# Altium project Communications.PrjPcb
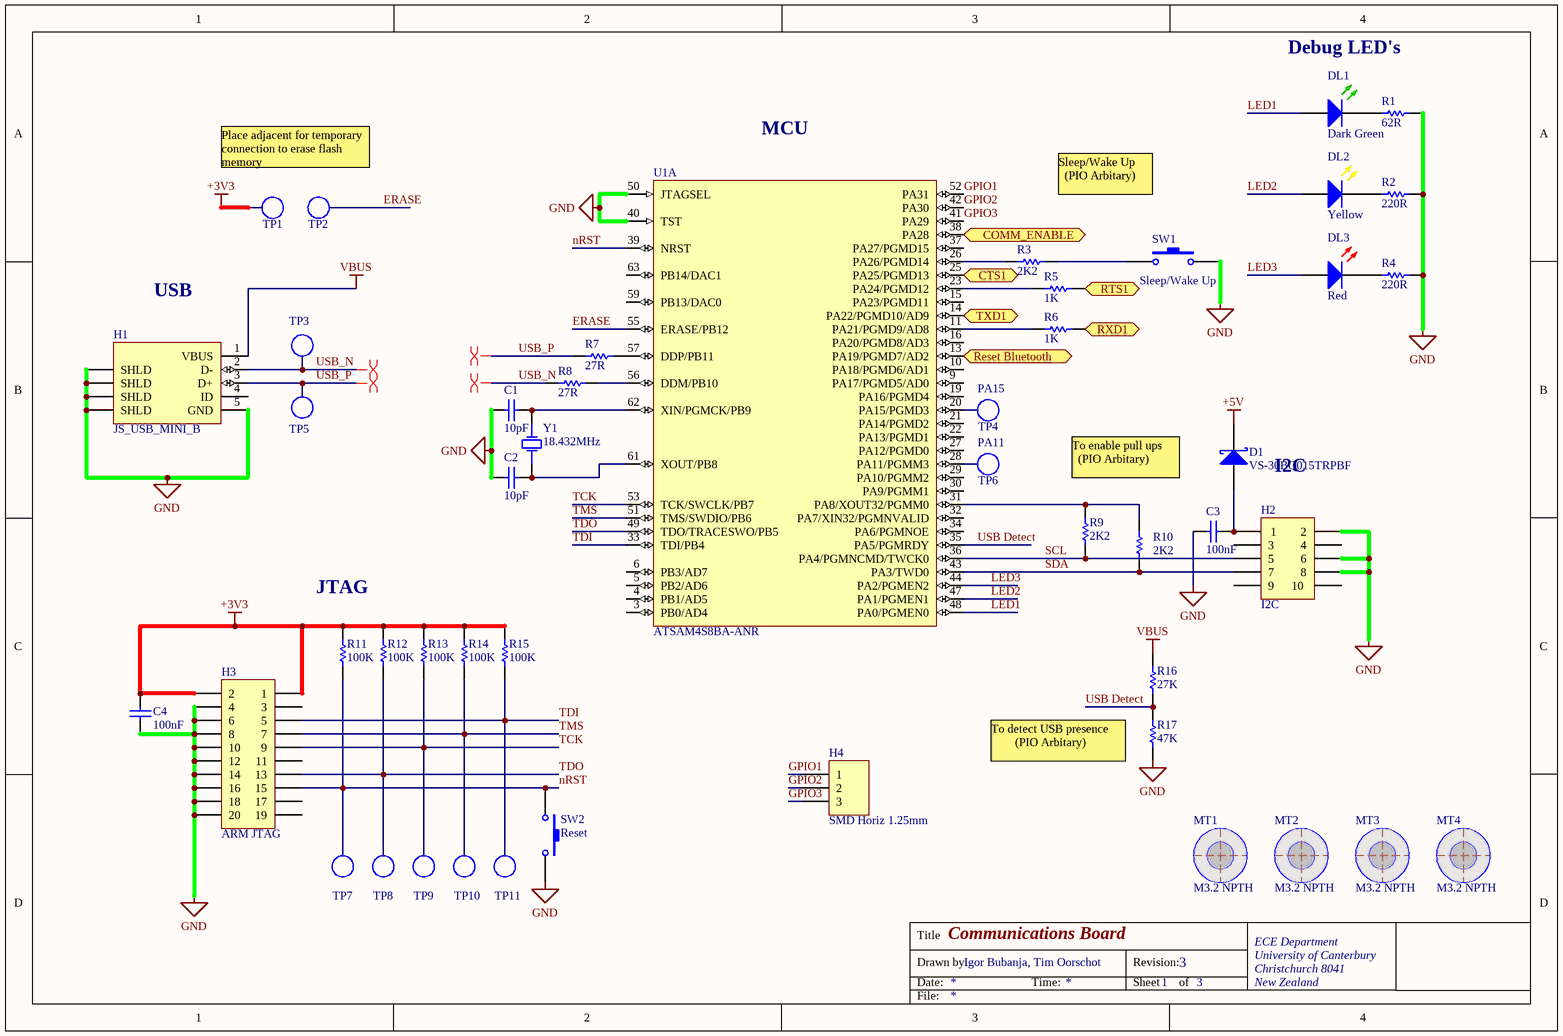
[diagram p0: Communications_Board.SchDoc]
3 sheets, 97 parts. Net scope: flat (ports and power ports of the same name join across sheets).
Board files: Igor's PCB.PcbDoc, Communications_Board.PcbDoc
Sheets:
  Communications_Board.SchDoc
  Communications_Module.SchDoc
  Communications_Power.SchDoc

## Sheet Communications_Board.SchDoc: Communications Board
size A4; DrawnBy: Igor Bubanja, Tim Oorschot; Address1: ECE Department; Address2: University of Canterbury; Address3: Christchurch 8041; Address4: New Zealand; Revision: 3; SheetNumber: 1; SheetTotal: 3; PageSetup: Record=PageOptions|CenterHorizontal=True|CenterVertical=True|PrintScale=0.97|XCorrection=1.00|YCorrection=1.00|PrintKind=0|BorderSize=5000000|LeftOffset=0|BottomOffset=0|Orientation=2|PaperLength=1000|PaperWidth=1000|Scale=100|PaperSource=7|PrintQuality=-3|MediaType=1|DitherType=10|PrintScaleMode=1|PaperKind=A4 (210 x 297 mm)|PaperIndex=9

### Parts
C1  10pF  [CAPC1608L]
C2  10pF  [CAPC1608L]
C3  100nF  [CAPC1608L]
C4  100nF  [CAPC1608L]
D1  VS-30BQ015TRPBF  [SMC]
DL1  Dark Green  [WL-SMCW0603]
DL2  Yellow  [WL-SMCW0603]
DL3  Red  [WL-SMCW0603]
H1  JS_USB_MINI_B  [USB/SM0.8-6H5]
H2  I2C  [188275-10]
H3  ARM JTAG  [188275-20]
H4  SMD Horiz 1.25mm  [SD-53261-0319]
MT1  M3.2 NPTH  [MNT-HOLE_3.2mm_NPTH]  (no BOM)
MT2  M3.2 NPTH  [MNT-HOLE_3.2mm_NPTH]  (no BOM)
MT3  M3.2 NPTH  [MNT-HOLE_3.2mm_NPTH]  (no BOM)
MT4  M3.2 NPTH  [MNT-HOLE_3.2mm_NPTH]  (no BOM)
R1  62R  [RESC1608L]
R2  220R  [RESC1608L]
R3  2K2  [RESC1608L]
R4  220R  [RESC1608L]
R5  1K  [RESC1608L]
R6  1K  [RESC1608L]
R7  27R  [RESC1608L]
R8  27R  [RESC1608L]
R9  2K2  [RESC1608L]
R10  2K2  [RESC1608L]
R11  100K  [RESC1608L]
R12  100K  [RESC1608L]
R13  100K  [RESC1608L]
R14  100K  [RESC1608L]
R15  100K  [RESC1608L]
R16  27K  [RESC1608N]
R17  47K  [RESC1608N]
SW1  Sleep/Wake Up  [KSR211G]
SW2  Reset  [KSR211G]
TP1  3V3  [TP_0805]  (value not drawn)
TP2  Erase  [TP_0805]  (value not drawn)
TP3  USB_N  [TP_0805]  (value not drawn)
TP4  PA15  [TP_0805]
TP5  USB_P  [TP_0805]  (value not drawn)
TP6  PA11  [TP_0805]
TP7  nRST  [TP_0805]  (value not drawn)
TP8  TDO  [TP_0805]  (value not drawn)
TP9  TCK  [TP_0805]  (value not drawn)
TP10  TMS  [TP_0805]  (value not drawn)
TP11  TDI  [TP_0805]  (value not drawn)
U1  ATSAM4S8BA-ANR  [LQFP64_L]  (part A of 2)
Y1  18.432MHz  [6.0X3.5-4]

### Ports
COMM_ENABLE (out), CTS1, Reset Bluetooth (out), RTS1, RXD1, TXD1

### Nets
+3V3: C4.2 H3.1 H3.2 R11.2 R12.2 R13.2 R14.2 R15.2 TP1.1(TP)
+5V: D1.2(K)
GND: C1.1 C2.1 C3.1 C4.1 H1.5(GND) H1.6(SHLD) H1.7(SHLD) H1.8(SHLD) H1.9(SHLD) H2.2 H2.6 H2.8 H3.4 H3.6 H3.8 H3.10 H3.12 H3.14 H3.16 H3.18 H3.20 R1.2 R2.2 R4.2 R17.1 SW1.2 SW2.2 U1.40(TST) U1.50(JTAGSEL)
VBUS: H1.1(VBUS) R16.2
ERASE: TP2.1(TP) U1.55(ERASE/PB12)
GPIO1: H4.1 U1.52(PA31)
GPIO2: H4.2 U1.42(PA30)
GPIO3: H4.3 U1.41(PA29)
LED1: DL1.2(A) U1.48(PA0/PGMEN0)
LED2: DL2.2(A) U1.47(PA1/PGMEN1)
LED3: DL3.2(A) U1.44(PA2/PGMEN2)
nRST: H3.15 R11.1 SW2.1 TP7.1(TP) U1.39(NRST)
SCL: H2.5 R9.1 U1.36(PA4/PGMNCMD/TWCK0)
SDA: H2.7 R10.1 U1.43(PA3/TWD0)
TCK: H3.9 R13.1 TP9.1(TP) U1.53(TCK/SWCLK/PB7)
TDI: H3.5 R15.1 TP11.1(TP) U1.33(TDI/PB4)
TDO: H3.13 R12.1 TP8.1(TP) U1.49(TDO/TRACESWO/PB5)
TMS: H3.7 R14.1 TP10.1(TP) U1.51(TMS/SWDIO/PB6)
USB Detect: R16.1 R17.2 U1.35(PA5/PGMRDY)
USB_N: H1.2(D-) R8.1 TP3.1(TP)
USB_P: H1.3(D+) R7.1 TP5.1(TP)
NetC1_2: C1.2 U1.62(XIN/PGMCK/PB9) Y1.3(OSC2)
NetC2_2: C2.2 U1.61(XOUT/PB8) Y1.1(OSC1)
NetC3_2: C3.2 D1.1(A) H2.1
NetDL1_1: DL1.1(K) R1.1
NetDL2_1: DL2.1(K) R2.1
NetDL3_1: DL3.1(K) R4.1
NetR3_1: R3.1 U1.26(PA26/PGMD14)
NetR3_2: R3.2 SW1.1
NetR5_1: R5.1 U1.23(PA24/PGMD12)
NetR5_2: R5.2 ; port RTS1
NetR6_1: R6.1 U1.11(PA21/PGMD9/AD8)
NetR6_2: R6.2 ; port RXD1
NetR7_2: R7.2 U1.57(DDP/PB11)
NetR8_2: R8.2 U1.56(DDM/PB10)
NetR9_2: R9.2 R10.2 U1.31(PA8/XOUT32/PGMM0)
NetR19_1: U1.13(PA19/PGMD7/AD2) ; port Reset Bluetooth
NetRN41_13: U1.14(PA22/PGMD10/AD9) ; port TXD1
NetRN41_15: U1.25(PA25/PGMD13) ; port CTS1
NetTP4_1: TP4.1(TP) U1.20(PA15/PGMD3)
NetTP6_1: TP6.1(TP) U1.28(PA11/PGMM3)
NetTP14_1: U1.38(PA28) ; port COMM_ENABLE

Not connected (* = marked no-connect by the designer): H1 4(ID); H2 3 4 9 10; H3 3 11 17 19; U1 3(PB0/AD4) 4(PB1/AD5) 5(PB2/AD6) 6(PB3/AD7) 9(PA17/PGMD5/AD0) 10(PA18/PGMD6/AD1) 15(PA23/PGMD11) 16(PA20/PGMD8/AD3) 19(PA16/PGMD4) 21(PA14/PGMD2) 22(PA13/PGMD1) 27(PA12/PGMD0) 29(PA10/PGMM2) 30(PA9/PGMM1) 32(PA7/XIN32/PGMNVALID) 34(PA6/PGMNOE) 37(PA27/PGMD15) 59(PB13/DAC0) 63(PB14/DAC1)

### Layout directives
differential pair: USB_N, USB_P

### Notes on the sheet
- Debug LED's
- Place adjacent for temporary
  connection to erase flash
  memory
- MCU
- Sleep/Wake Up
  (PIO Arbitary)
- USB
- To enable pull ups
  (PIO Arbitary)
- I2C
- JTAG
- To detect USB presence
  (PIO Arbitary)
- Title
- Drawn by:
- Date:
- Time:
- Revision:
- Sheet
- of
- File:

### Library data of the parts
C1 C2 = CC_10pF_0603: CAP CER 10pF COG/NPO 50V 0603; PackageReference: 0603; Code_IPC: 1005 [0402]; Verify: *; Supplier: ECE Dept; Storage Location: PCB Assembly WS; Value: 10pF
C3 C4 = CC_100nF_0603: CAP CER 100nF X7R +-10% 50V 0603; PackageReference: 0603; Code_IPC: 1608 [0603]; Verify: *; Supplier: ECE Dept; Storage Location: PCB Assembly WS; Value: 100nF
D1 = DS_VS-30BQD015TRPBF: DIODE SCHOTTKY 15V 3A SMC; Manufacturer: Vishay Semiconductor Diodes Division; Current - Reverse Leakage @ Vr: 4mA @ 15V; Voltage - Forward (Vf) (Max) @ If: 350mV @ 3A; Current - Average Rectified (Io): 3A; Package / Case: DO-214AB, SMC; Pricing: 1=1.59, 10=1.417, 25=1.2504, 100=1.1253, 250=0.97944, 500=0.87526, 1000=0.6877 (NZD); Supplier 1: Digi-Key; Supplier Part Number 1: 30BQ015PBFCT-ND; Supplier 2: Farnell; Supplier Part Number 2: 9101250; Supplier 3: Mouser; Supplier Part Number 3: N/A; Storage Location: PCB Assembly WS; Supplier: ECE Dept; Manufacturer Part Number: VS-30BQ015TRPBF
DL1 = DL_150060GS75000: LED Dk Green 430mcd 0603 SMD; Manufacturer: WURTH ELEKTRONIK; Forward Current If: 30; Wavelength Typ: 520; Forward Voltage: 3.2; Lens Shape: Rectangular; Luminous Intensity: 430; Viewing Angle: 140°; LED Mounting: SMD; Supplier 1: Farnell; Supplier Part Number 1: 2322070; Manufacturer Part Number: 150060GS75000; Storage Location: PCB Assembly WS; Supplier: ECE Dept; LED Colour: Dark Green
DL2 = DL_150060YS75000: LED Yellow 120mcd 0603 SMD; Manufacturer: WURTH ELEKTRONIK; Forward Current If: 30; Forward Voltage: 2; Wavelength Typ: 590; Lens Shape: Rectangular; Viewing Angle: 140°; Luminous Intensity: 120; LED Mounting: SMD; Supplier 1: Farnell; Supplier Part Number 1: 2322074; Manufacturer Part Number: 150060YS75000; Storage Location: PCB Assembly WS; Supplier: ECE Dept; LED Colour: Yellow
DL3 = DL_150060RS75000: LED Red 250mcd 0603 SMD; Manufacturer: WURTH ELEKTRONIK; Forward Current If: 30; Forward Voltage: 2; Lens Shape: Rectangular; Luminous Intensity: 250; Wavelength Typ: 625; Viewing Angle: 140°; LED Mounting: SMD; Supplier 1: Farnell; Supplier Part Number 1: 2322071; Manufacturer Part Number: 150060RS75000; Storage Location: PCB Assembly WS; Supplier: ECE Dept; LED Colour: Red
H1 = JS_USB_MINI_B_SMT: USB 2.0, Right Angle, SMT, B Type, Receptacle, 5 Position,; Manufacturer: FCI; Manufacturer PN: 10033526-N3212MLF; Supplier 1: Farnell; Supplier Part Number 1: 1824416; Storage Location: PCB Assembly WS; Supplier: ECE Dept
H2 = JB_HDR_IDC_5X2_VERT: IDC Header, 1,27mm, 10-Pin, Vert, SMT; Manufacturer: TE Connectivity; Manufacturer Part Number: 1-188275-0; Current Rating: 1.5 A; Mounting Angle: Vertical; Number of Positions / Contacts: 10; Pitch: 1.27 mm; Supplier: ECE Dept; Mounting Style: SMD/SMT; Storage Location: PCB Assembly WS; Supplier 1: Digi-Key; Supplier Part Number 1: A99476TR-ND
H3 = JB_HDR_IDC_10X2_VERT: IDC Header, 1,27mm, 20-Pin, Vert, SMT; Manufacturer: TE Connectivity; Manufacturer Part Number: 2-188275-0; Mounting Angle: Vertical; Number of Positions / Contacts: 20; Pitch: 1.27 mm; Mounting Style: SMD/SMT; Supplier: ECE Dept; Storage Location: PCB Assembly WS; Supplier 1: Digi-Key; Supplier Part Number 1: A99481CT-ND
H4 = JB_53261-03: Header_Horiz_3Pos_1.25mm_125V@1A_SMT; Manufacturer: Molex; Manufacturer Part Number: 53261-0390; Number of Positions: 3; Pitch: 0.049" (1.25mm); Contact Type: Blade Pin; Mounting Type: Surface Mount, Right Angle; Supplier 1: Farnell; Supplier Part Number 1: 1125359; Supplier 2: Digi-Key; Supplier Part Number 2: WM1754CT-ND; Supplier: ECE Dept; Storage Location: PCB Assembly WS; Value: SMD Horiz 1.25mm
MT1-MT4 = MC_M3.2_HOLE: Fixing M3.2 Mount Hole NPTH; Manufacturer: Hi-Q; Manufacturer PN: 3BV series M3 Clearance; price: 0; Supplier: ECE Dept; value: M3.2 NPTH
R1 = RS_62R: RES 62 OHM 1/10W 5% 0603 SMD; Storage Location: PCB Assembly WS; Supplier: ECE Dept; Value: 62R
R2 R4 = RS_220R: RES 220 OHM 1/10W 5% 0603 SMD; Storage Location: PCB Assembly WS; Supplier: ECE Dept; Value: 220R
R3 R9 R10 = RS_2K2: RES 2.2K OHM 1/10W 5% 0603 SMD; Storage Location: PCB Assembly WS; Supplier: ECE Dept; Value: 2K2
R5 R6 = RS_1K: RES 1.0K OHM 1/10W 5% 0603 SMD; Storage Location: PCB Assembly WS; Supplier: ECE Dept; Value: 1K
R7 R8 = RS_27R: RES 27 OHM 1/10W 5% 0603 SMD; Storage Location: PCB Assembly WS; Supplier: ECE Dept; Value: 27R
R11-R15 = RS_100K: RES 100K OHM 1/10W 5% 0603 SMD; Storage Location: PCB Assembly WS; Supplier: ECE Dept; Value: 100K
R16 = RS_27K: RES 27K OHM 1/10W 5% 0603 SMD; Storage Location: PCB Assembly WS; Supplier: ECE Dept; Value: 27K
R17 = RS_47K: RES 47.0K OHM 1/10W 5% 0603 SMD; Storage Location: PCB Assembly WS; Supplier: ECE Dept; Value: 47K
SW1 SW2 = WS_KSR211G LFS: SWITCH TACTILE SPST-NO SMD; Manufacturer: C & K COMPONENTS; Contact Current Max: 50; Contact Resistance: 100; Contact Voltage DC Nom: 32; Operating Force: 1.8; Contact Configuration: SPST-NO; Pricing: 1=0.538, 50=0.477, 100=0.416, 2500=0.219 (NZD); Supplier 1: Farnell; Supplier Part Number 1: 1437634; Storage Location: PCB Assembly WS; Supplier: ECE Dept; Manufacturer Part Number: KSR211G LFS
TP1-TP11 = TP_0805: Test Point 2.0X0.9X1.2mm SMD; Manufacturer: TE Connectivity AMP Connectors; Manufacturer Part Number: 1625854-2; Supplier 1: Digi-Key; Mounting Type: Surface Mount; Terminal: 0.079" x 0.049" x 0.057" (2.00mm x 1.25mm x 1.45mm); Type: PC Test Point; Supplier Part Number 1: A106144CT-ND
U1 = SE_ATSAM4S16BA-MU: IC MCU 32BIT 512KB FLASH 64LQFP; Manufacturer: Atmel; Connectivity: I²C, IrDA, Memory Card, SPI, SSC, UART/USART, USB; Core Processor: ARM® Cortex®-M4; Core Size: 32-Bit; Data Converters: A/D 11x12b, D/A 2x12b; Number of I/O: 47; Peripherals: Brown-out Detect/Reset, DMA, POR, PWM, WDT; Program Memory Size: 512KB (512K x 8); RAM Size: 128K x 8; Speed: 120MHz; Voltage - Supply (Vcc/Vdd): 1.62 V ~ 3.6 V; PackageVersion: revJ, Jul-2007; PackageReference: 64PS; PackageDescription: 64-Pin Quad Flat No-Lead (QFN) Sawn, 9 x 9 x 1.0 mm Body, 0.5 mm Pitch, Exposed Pad; Code_JEDEC: MO-220VMMD-3; ComponentLink1Description: Manufacturer URL; ComponentLink1URL: http://www.atmel.com/; ComponentLink2Description: SAM4S Series Datasheet; ComponentLink2URL: http://www.atmel.com/dyn/resources/prod_documents/11100.pdf; ComponentLink3Description: SAM4S Series Summary; ComponentLink3URL: http://www.atmel.com/dyn/resources/prod_documents/11100S.pdf; Supplier 1: Digi-Key; Package / Case: 64-LQFP; Packaging: Cut Tape (CT); Program Memory Type: FLASH; Supplier Part Number 1: ATSAM4S8BA-ANRCT-ND; Manufacturer Part Number: ATSAM4S8BA-ANR
Y1 = XT_CRYSTAL_18.432MHz_13pF: 18.432 MHZ 4PF  6.0X3.5mm SMD; Manufacturer: CTS-Frequency Controls; Manufacturer Part Number: 406C35B18M43200; ESR (Equivalent Series Resistance): 40 Ohm; Frequency Stability: ±50ppm; Frequency Tolerance: ±30ppm; Load Capacitance: 13pF; Supplier 1: Digi-Key; Height: 0.047" (1.20mm); Mounting Type: Surface Mount; Package / Case: 4-SMD, No Lead (DFN, LCC); Size / Dimension: 0.236" L x 0.138" W (6.00mm x 3.50mm); Supplier Part Number 1: CTX668CT-ND; Frequency: 18.432MHz

## Sheet Communications_Module.SchDoc: Communications Modules
size A3; DrawnBy: Igor Bubanja, Tim Oorschot; Organization: Group 7; Address1: ECE Department; Address2: University of Canterbury; Address3: Christchurch 8041; Address4: New Zealand; Revision: 1; SheetNumber: 3; SheetTotal: 3
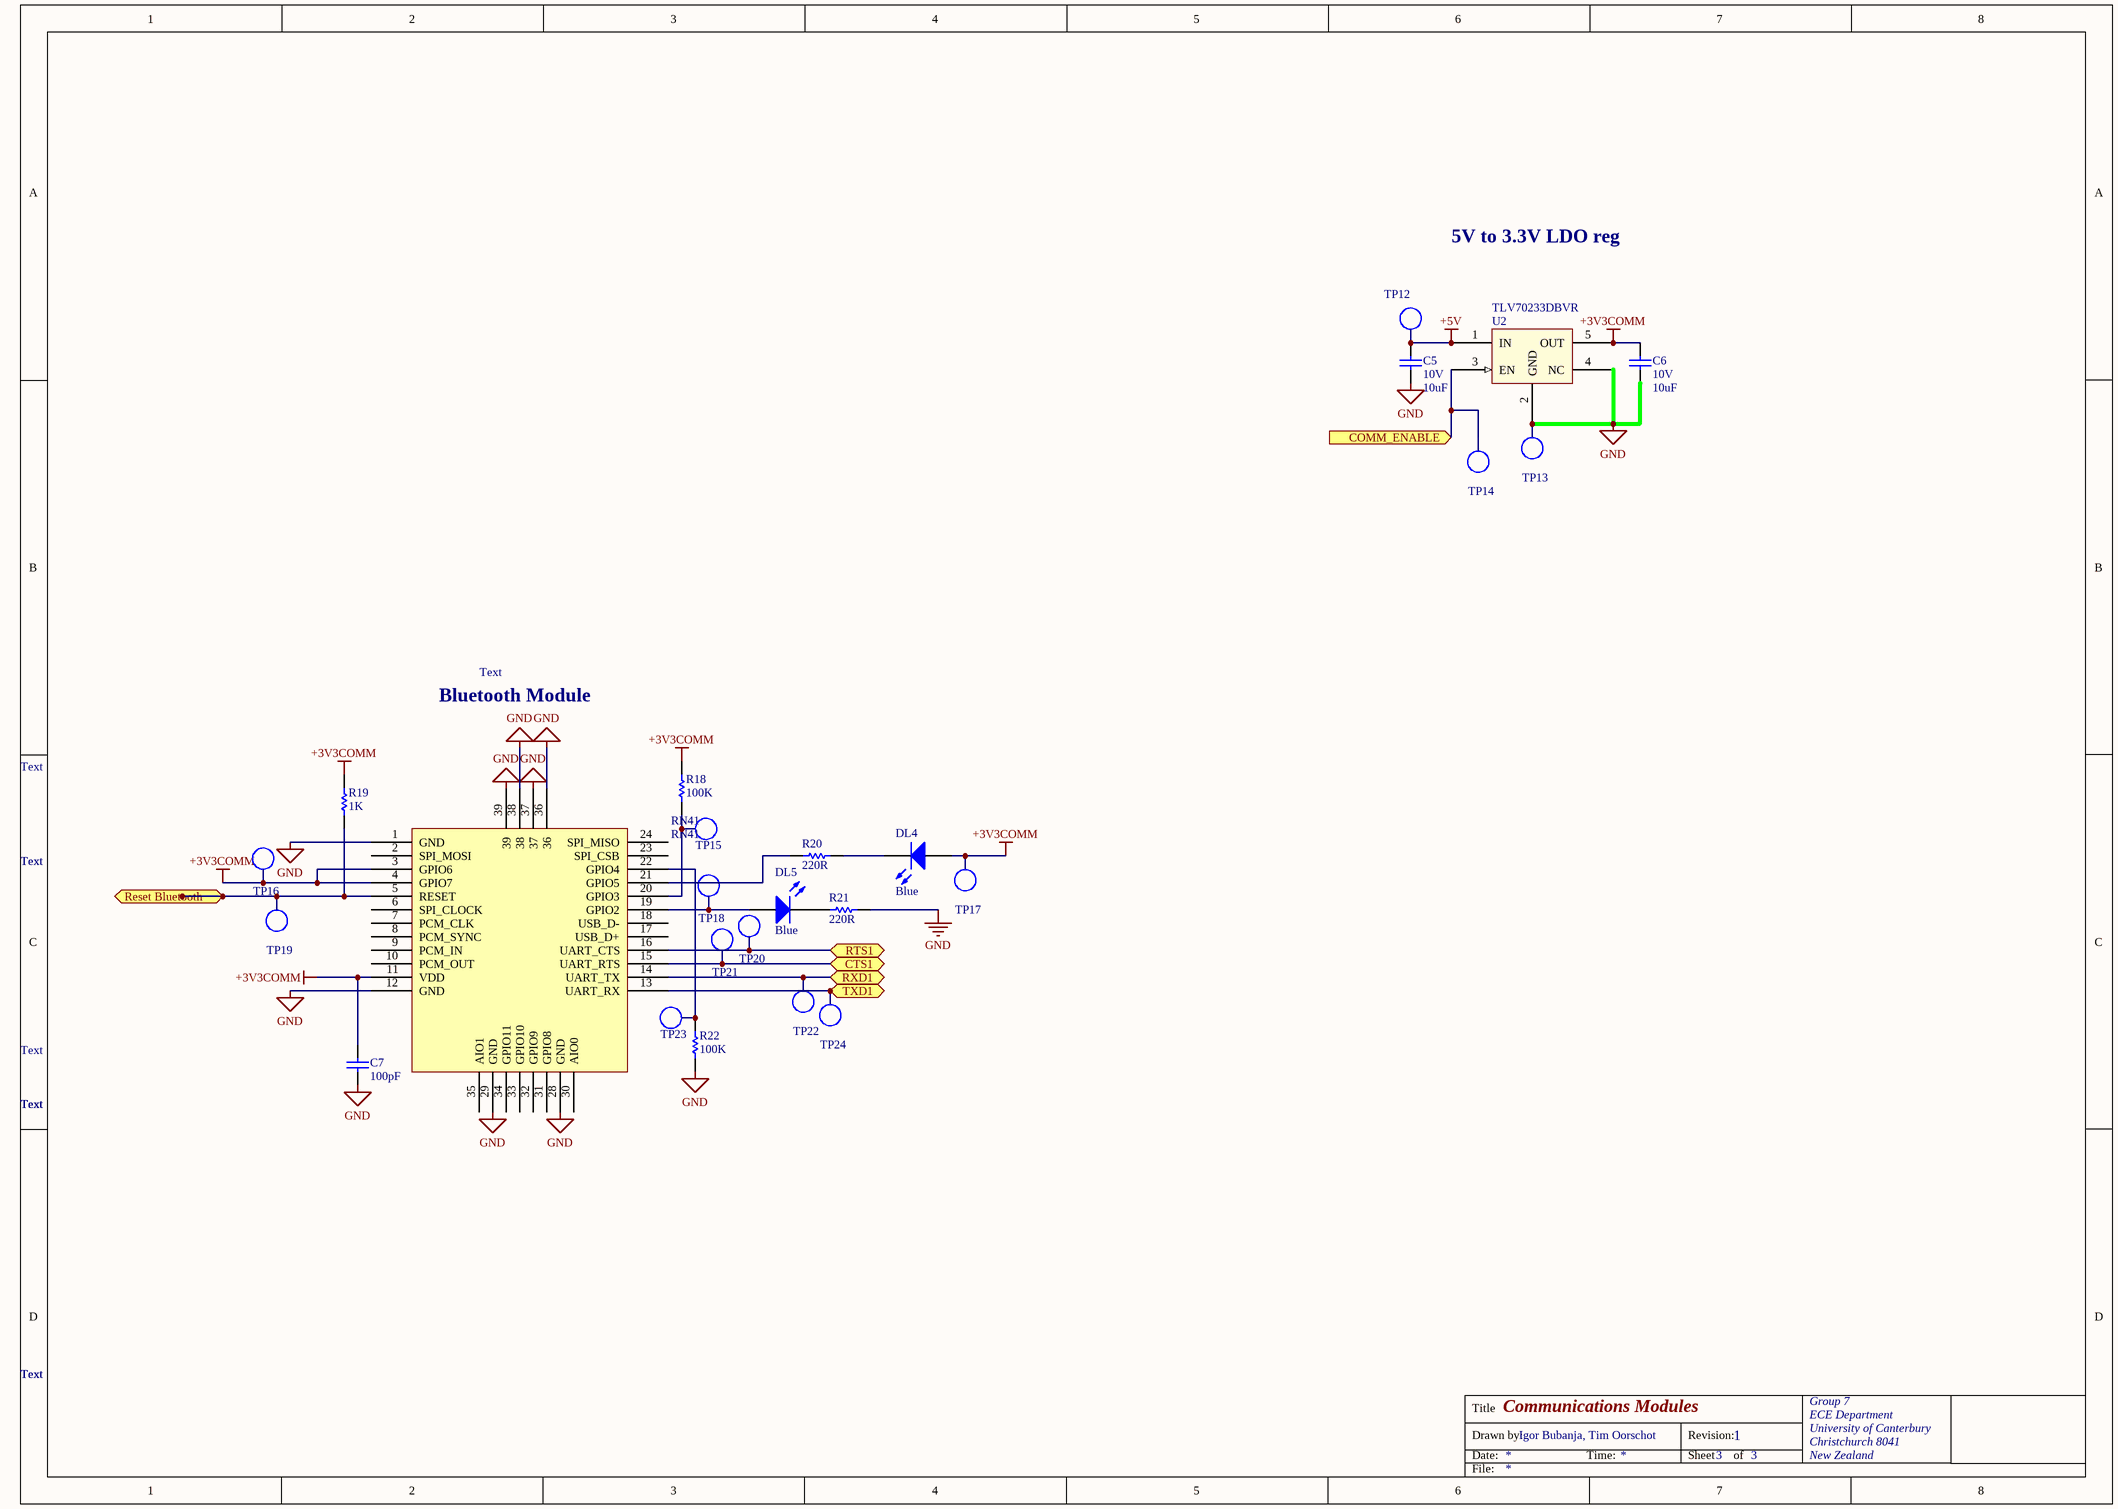
[diagram p1: Communications_Module.SchDoc]

### Parts
C5  Voltage - Rated: 10V  [CAPC1608L]  (hidden comment: 10uF)
C6  Voltage - Rated: 10V  [CAPC1608L]  (hidden comment: 10uF)
C7  100pF  [CAPC1608L]
DL4  Blue  [WL-SMCW0603]
DL5  Blue  [WL-SMCW0603]
R18  100K  [RESC1608L]
R19  1K  [RESC1608L]
R20  220R  [RESC1608L]
R21  220R  [RESC1608L]
R22  100K  [RESC1608L]
RN41  RN41  [PCBComponent_1]
TP12  V_Bus  [TP_0805]  (value not drawn)
TP13  Gnd  [TP_0805]  (value not drawn)
TP14  Gnd  [TP_0805]  (value not drawn)
TP15  Gnd  [TP_0805]  (value not drawn)
TP16  Gnd  [TP_0805]  (value not drawn)
TP17  Gnd  [TP_0805]  (value not drawn)
TP18  Gnd  [TP_0805]  (value not drawn)
TP19  Gnd  [TP_0805]  (value not drawn)
TP20  Gnd  [TP_0805]  (value not drawn)
TP21  Gnd  [TP_0805]  (value not drawn)
TP22  Gnd  [TP_0805]  (value not drawn)
TP23  Gnd  [TP_0805]  (value not drawn)
TP24  Gnd  [TP_0805]  (value not drawn)
U2  TLV70233DBVR  [SOT95P280X145-5N]

### Ports
COMM_ENABLE (in), CTS1, Reset Bluetooth, RTS1, RXD1, TXD1

### Nets
+3V3COMM: C6.1 C7.2 DL4.2(A) R18.2 R19.2 RN41.3(GPIO6) RN41.4(GPIO7) RN41.11(VDD) TP16.1(TP) TP17.1(TP) U2.5(OUT)
+5V: C5.1 TP12.1(TP) U2.1(IN)
GND: C5.2 C6.2 C7.1 R21.2 R22.1 RN41.1(GND) RN41.12(GND) RN41.28(GND) RN41.29(GND) RN41.36 RN41.37 RN41.38 RN41.39 TP13.1(TP) U2.2(GND) U2.4(NC)
NetDL4_1: DL4.1(K) R20.2
NetDL5_1: DL5.1(K) R21.1
NetDL5_2: DL5.2(A) RN41.19(GPIO2) TP18.1(TP)
NetR5_2: RN41.16(UART_CTS) TP20.1(TP) ; port RTS1
NetR6_2: RN41.14(UART_TX) TP22.1(TP) ; port RXD1
NetR18_1: R18.1 RN41.20(GPIO3) TP15.1(TP)
NetR19_1: R19.1 RN41.5(RESET) TP19.1(TP) ; port Reset Bluetooth
NetR20_1: R20.1 RN41.21(GPIO5)
NetR22_2: R22.2 RN41.22(GPIO4) TP23.1(TP)
NetRN41_13: RN41.13(UART_RX) TP24.1(TP) ; port TXD1
NetRN41_15: RN41.15(UART_RTS) TP21.1(TP) ; port CTS1
NetTP14_1: TP14.1(TP) U2.3(EN) ; port COMM_ENABLE

Not connected (* = marked no-connect by the designer): RN41 2(SPI_MOSI) 6(SPI_CLOCK) 7(PCM_CLK) 8(PCM_SYNC) 9(PCM_IN) 10(PCM_OUT) 17(USB_D+) 18(USB_D-) 23(SPI_CSB) 24(SPI_MISO) 30(AIO0) 31(GPIO8) 32(GPIO9) 33(GPIO10) 34(GPIO11) 35(AIO1)

### Notes on the sheet
- 5V to 3.3V LDO reg
- Bluetooth Module
- Text
- Title
- Drawn by:
- Date:
- Time:
- Revision:
- Sheet
- of
- File:

### Library data of the parts
C5 C6 = CC_10uF_0603: CAP CER 10UF X5R +-20% 10V 0603; Supplier: ECE Dept; Storage Location: PCB Assembly WS; Value: 10uF
C7 = CC_100pF_0603: CAP CER 100pF NPO/COG +-5% 50V 0603; PackageReference: 0603; Code_IPC: 1608 [0603]; Verify: *; Supplier: ECE Dept; Storage Location: PCB Assembly WS; Value: 100pF
DL4 DL5 = DL_150060BS75000: LED Blue 270mcd 0603 SMD; Manufacturer: WURTH ELEKTRONIK; Forward Current If: 30; Forward Voltage: 3.2; Luminous Intensity: 270; Viewing Angle: 120°; Wavelength Typ: 470; Pricing: 1=0.3844, 50=0.3252, 100=0.2957, 500=0.2365 (NZD); Supplier 1: Farnell; Supplier Part Number 1: 2322069; Manufacturer Part Number: 150060BS75000; Storage Location: PCB Assembly WS; Supplier: ECE Dept; LED Colour: Blue
R18 R22 = RS_100K: RES 100K OHM 1/10W 5% 0603 SMD; Storage Location: PCB Assembly WS; Supplier: ECE Dept; Value: 100K
R19 = RS_1K: RES 1.0K OHM 1/10W 5% 0603 SMD; Storage Location: PCB Assembly WS; Supplier: ECE Dept; Value: 1K
R20 R21 = RS_220R: RES 220 OHM 1/10W 5% 0603 SMD; Storage Location: PCB Assembly WS; Supplier: ECE Dept; Value: 220R
RN41 = RN41: Bluetooth RN41
TP12-TP24 = TP_0805: as TP1 on sheet Communications_Board; Supplier 1: Digi-Key; Mounting Type: Surface Mount; Terminal: 0.079" x 0.049" x 0.057" (2.00mm x 1.25mm x 1.45mm); Type: PC Test Point; Supplier Part Number 1: A106144CT-ND
U2 = SV_TLV70233DBVR: IC REG LDO 3.3V 0.3A SOT23-5; Manufacturer: Texas Instruments; Current - Output: 300mA; Supplier 1: Digi-Key; Operating Temperature: -40°C ~ 125°C; Package / Case: SC-74A, SOT-753; Pricing: 1=0.77, 10=0.647, 25=0.5672, 100=0.4853, 250=0.421, 500=0.35658, 750=0.30789, 1000=0.2749 (NZD); Supplier Part Number 1: 296-32415-1-ND; Manufacturer Part Number: TLV70233DBVR

## Sheet Communications_Power.SchDoc: Communications Power
size A4; DrawnBy: Igor Bubanja, Tim Oorschot; Address1: ECE Department; Address2: University of Canterbury; Address3: Christchurch 8041; Address4: New Zealand; Revision: 3; SheetNumber: 2; SheetTotal: 3; PageSetup: Record=PageOptions|CenterHorizontal=True|CenterVertical=True|PrintScale=0.97|XCorrection=1.00|YCorrection=1.00|PrintKind=0|BorderSize=5000000|LeftOffset=0|BottomOffset=0|Orientation=2|PaperLength=1000|PaperWidth=1000|Scale=100|PaperSource=7|PrintQuality=-3|MediaType=1|DitherType=10|PrintScaleMode=1|PaperKind=A4 (210 x 297 mm)|PaperIndex=9
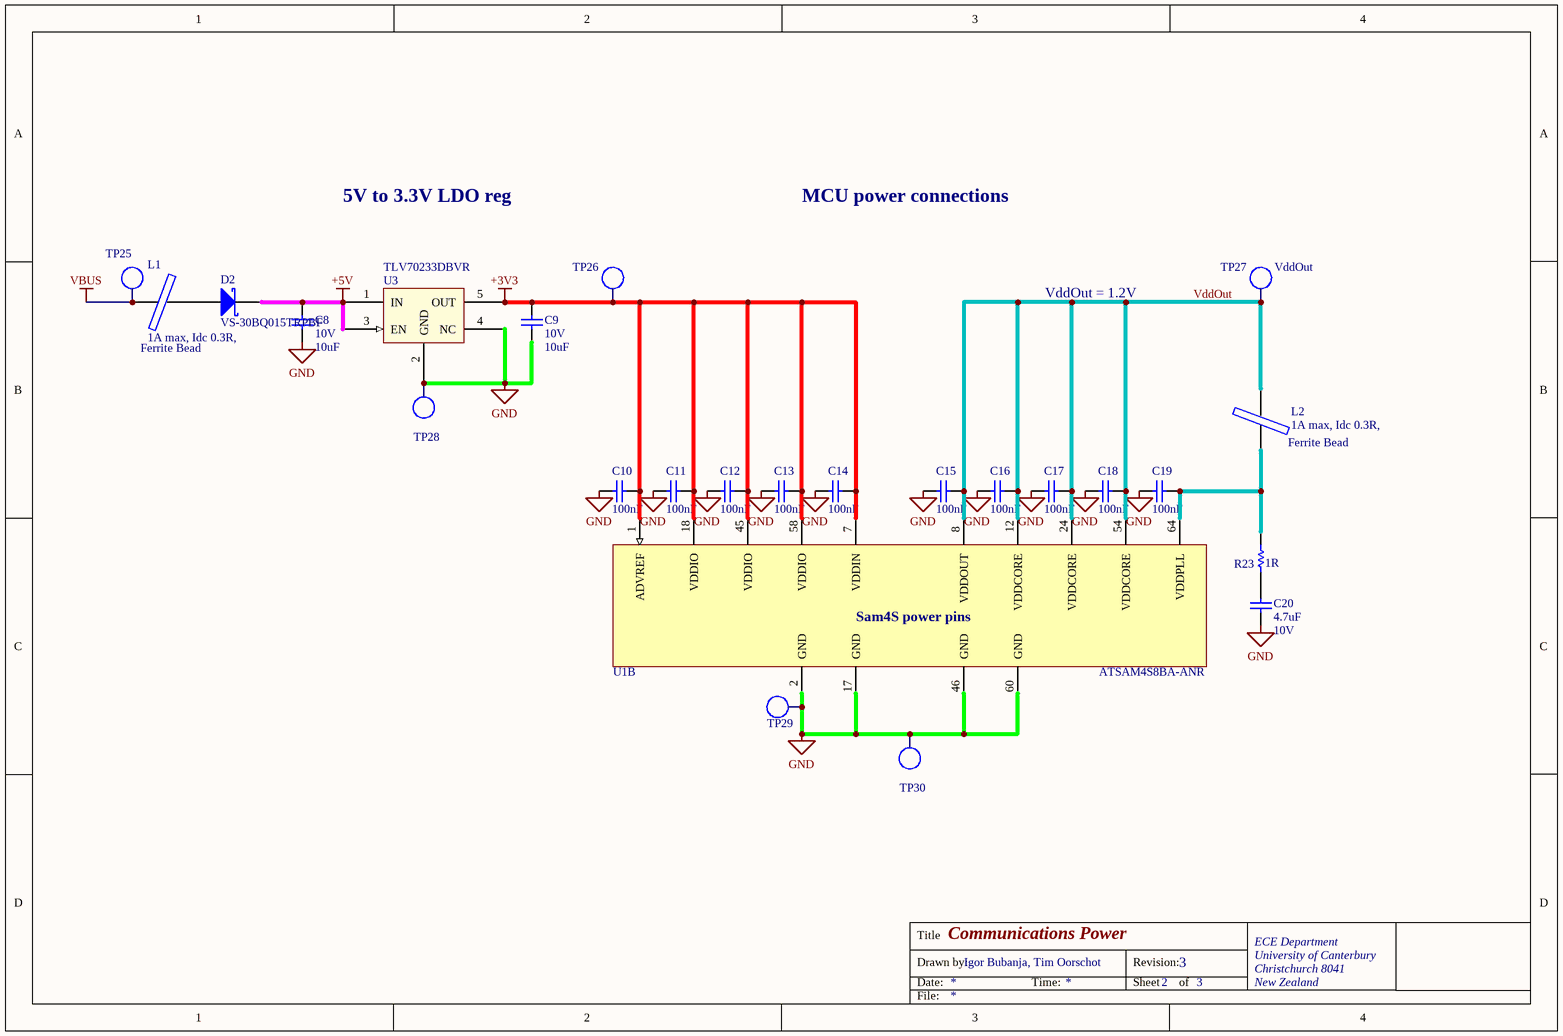
[diagram p2: Communications_Power.SchDoc]

### Parts
C8  Voltage - Rated: 10V  [CAPC1608L]  (hidden comment: 10uF)
C9  Voltage - Rated: 10V  [CAPC1608L]  (hidden comment: 10uF)
C10  100nF  [CAPC1608L]
C11  100nF  [CAPC1608L]
C12  100nF  [CAPC1608L]
C13  100nF  [CAPC1608L]
C14  100nF  [CAPC1608L]
C15  100nF  [CAPC1608L]
C16  100nF  [CAPC1608L]
C17  100nF  [CAPC1608L]
C18  100nF  [CAPC1608L]
C19  100nF  [CAPC1608L]
C20  Max Voltage: 10V  [CAPC1608N]  (hidden comment: 4.7uF)
D2  VS-30BQ015TRPBF  [SMC]
L1  Ferrite Bead  value 1A max, Idc 0.3R,  [INDC3216L]
L2  Ferrite Bead  value 1A max, Idc 0.3R,  [INDC3216L]
R23  1R  [RESC3216L]
TP25  V_Bus  [TP_0805]  (value not drawn)
TP26  3V3  [TP_0805]  (value not drawn)
TP27  VddOut  [TP_0805]
TP28  Gnd  [TP_0805]  (value not drawn)
TP29  Gnd  [TP_0805]  (value not drawn)
TP30  Gnd  [TP_0805]  (value not drawn)
U1  ATSAM4S8BA-ANR  [LQFP64_L]  (part B of 2)
U3  TLV70233DBVR  [SOT95P280X145-5N]

### Nets
+3V3: C9.1 C10.2 C11.2 C12.2 C13.2 C14.2 TP26.1(TP) U1.1(ADVREF) U1.7(VDDIN) U1.18(VDDIO) U1.45(VDDIO) U1.58(VDDIO) U3.5(OUT)
+5V: C8.1 D2.2(K) U3.1(IN) U3.3(EN)
GND: C8.2 C9.2 C10.1 C11.1 C12.1 C13.1 C14.1 C15.1 C16.1 C17.1 C18.1 C19.1 C20.1 TP28.1(TP) TP29.1(TP) TP30.1(TP) U1.2(GND) U1.17(GND) U1.46(GND) U1.60(GND) U3.2(GND) U3.4(NC)
VBUS: L1.1 TP25.1(TP)
VddOut: C15.2 C16.2 C17.2 C18.2 L2.2 TP27.1(TP) U1.8(VDDOUT) U1.12(VDDCORE) U1.24(VDDCORE) U1.54(VDDCORE)
NetC19_2: C19.2 L2.1 R23.2 U1.64(VDDPLL)
NetC20_2: C20.2 R23.1
NetD2_1: D2.1(A) L1.2

### Notes on the sheet
- 5V to 3.3V LDO reg
- MCU power connections
- VddOut = 1.2V
- (near U1) Sam4S power pins
- Title
- Drawn by:
- Date:
- Time:
- Revision:
- Sheet
- of
- File:

### Library data of the parts
C8 C9 = CC_10uF_0603: CAP CER 10UF X5R +-20% 10V 0603; Supplier: ECE Dept; Storage Location: PCB Assembly WS; Value: 10uF
C10-C19 = CC_100nF_0603: CAP CER 100nF X7R +-10% 50V 0603; PackageReference: 0603; Code_IPC: 1608 [0603]; Verify: *; Supplier: ECE Dept; Storage Location: PCB Assembly WS; Value: 100nF
C20 = CC_4.7uF_0603: CAP CER 4.7uF X5R +-20%  10V 0603; Note: Footprint corresponds to dimensions for bulk cassette packaging. This case size has tightened tolerances.; PackageReference: 0805; Code_IPC: 2012[0805]; Verify: *; Supplier: ECE Dept; Storage Location: PCB Assembly WS; Value: 4.7uF
D2 = DS_VS-30BQD015TRPBF: as D1 on sheet Communications_Board; Current - Average Rectified (Io): 3A; Package / Case: DO-214AB, SMC; Pricing: 1=1.59, 10=1.417, 25=1.2504, 100=1.1253, 250=0.97944, 500=0.87526, 1000=0.6877 (NZD); Supplier 1: Digi-Key; Supplier Part Number 1: 30BQ015PBFCT-ND; Supplier 2: Farnell; Supplier Part Number 2: 9101250; Supplier 3: Mouser; Supplier Part Number 3: N/A; Storage Location: PCB Assembly WS; Supplier: ECE Dept; Manufacturer Part Number: VS-30BQ015TRPBF
L1 L2 = IN_Ferrite-Bead: Ferrite Bead, Rdc 0.3R, Z100MHZ 600R, Imax 1A, SMD 1206; Manufacturer: FAIR-RITE; Manufacturer PN: 2512066017Y1; DC Current Rating: 1; DC Resistance Max: 0.08; Ferrite Case Style: 1206 ^3216 Metric]; Frequency Range: 50MHz to 1; Impedance: 600; Impedance Tolerance: ± 25%; Supplier: ECE Dept; Storage Location: PCB Assembly WS; Ferrite Mounting: SMD; Supplier 1: Farnell; Supplier Part Number 1: 1612060; Manufacturer Part Number: 2512066017Y1
R23 = RT_1R: RES 1R OHM 1/4W 5% 1206 SMD; Storage Location: PCB Assembly WS; Supplier: ECE Dept; Value: 1R
TP25-TP30 = TP_0805: as TP1 on sheet Communications_Board; Supplier 1: Digi-Key; Mounting Type: Surface Mount; Terminal: 0.079" x 0.049" x 0.057" (2.00mm x 1.25mm x 1.45mm); Type: PC Test Point; Supplier Part Number 1: A106144CT-ND
U1 = SE_ATSAM4S16BA-MU: as U1 on sheet Communications_Board; PackageVersion: revJ, Jul-2007; PackageReference: 64PS; PackageDescription: 64-Pin Quad Flat No-Lead (QFN) Sawn, 9 x 9 x 1.0 mm Body, 0.5 mm Pitch, Exposed Pad; Code_JEDEC: MO-220VMMD-3; ComponentLink1Description: Manufacturer URL; ComponentLink1URL: http://www.atmel.com/; ComponentLink2Description: SAM4S Series Datasheet; ComponentLink2URL: http://www.atmel.com/dyn/resources/prod_documents/11100.pdf; ComponentLink3Description: SAM4S Series Summary; ComponentLink3URL: http://www.atmel.com/dyn/resources/prod_documents/11100S.pdf; Supplier 1: Digi-Key; Package / Case: 64-LQFP; Packaging: Cut Tape (CT); Program Memory Type: FLASH; Supplier Part Number 1: ATSAM4S8BA-ANRCT-ND; Manufacturer Part Number: ATSAM4S8BA-ANR
U3 = SV_TLV70233DBVR: as U2 on sheet Communications_Module; Supplier 1: Digi-Key; Operating Temperature: -40°C ~ 125°C; Package / Case: SC-74A, SOT-753; Pricing: 1=0.77, 10=0.647, 25=0.5672, 100=0.4853, 250=0.421, 500=0.35658, 750=0.30789, 1000=0.2749 (NZD); Supplier Part Number 1: 296-32415-1-ND; Manufacturer Part Number: TLV70233DBVR

## Nets that join several sheets
+3V3: Communications_Board (9 pins), Communications_Power (13 pins)
+5V: Communications_Board (D1.2), Communications_Module (C5.1 TP12.1 U2.1), Communications_Power (C8.1 D2.2 U3.1 U3.3)
GND: Communications_Board (29 pins), Communications_Module (16 pins), Communications_Power (22 pins)
VBUS: Communications_Board (H1.1 R16.2), Communications_Power (L1.1 TP25.1)
NetR5_2: Communications_Board (R5.2), Communications_Module (RN41.16 TP20.1)
NetR6_2: Communications_Board (R6.2), Communications_Module (RN41.14 TP22.1)
NetR19_1: Communications_Board (U1.13), Communications_Module (R19.1 RN41.5 TP19.1)
NetRN41_13: Communications_Board (U1.14), Communications_Module (RN41.13 TP24.1)
NetRN41_15: Communications_Board (U1.25), Communications_Module (RN41.15 TP21.1)
NetTP14_1: Communications_Board (U1.38), Communications_Module (TP14.1 U2.3)